# EAGLE schematic furby (EAGLE 6.3)
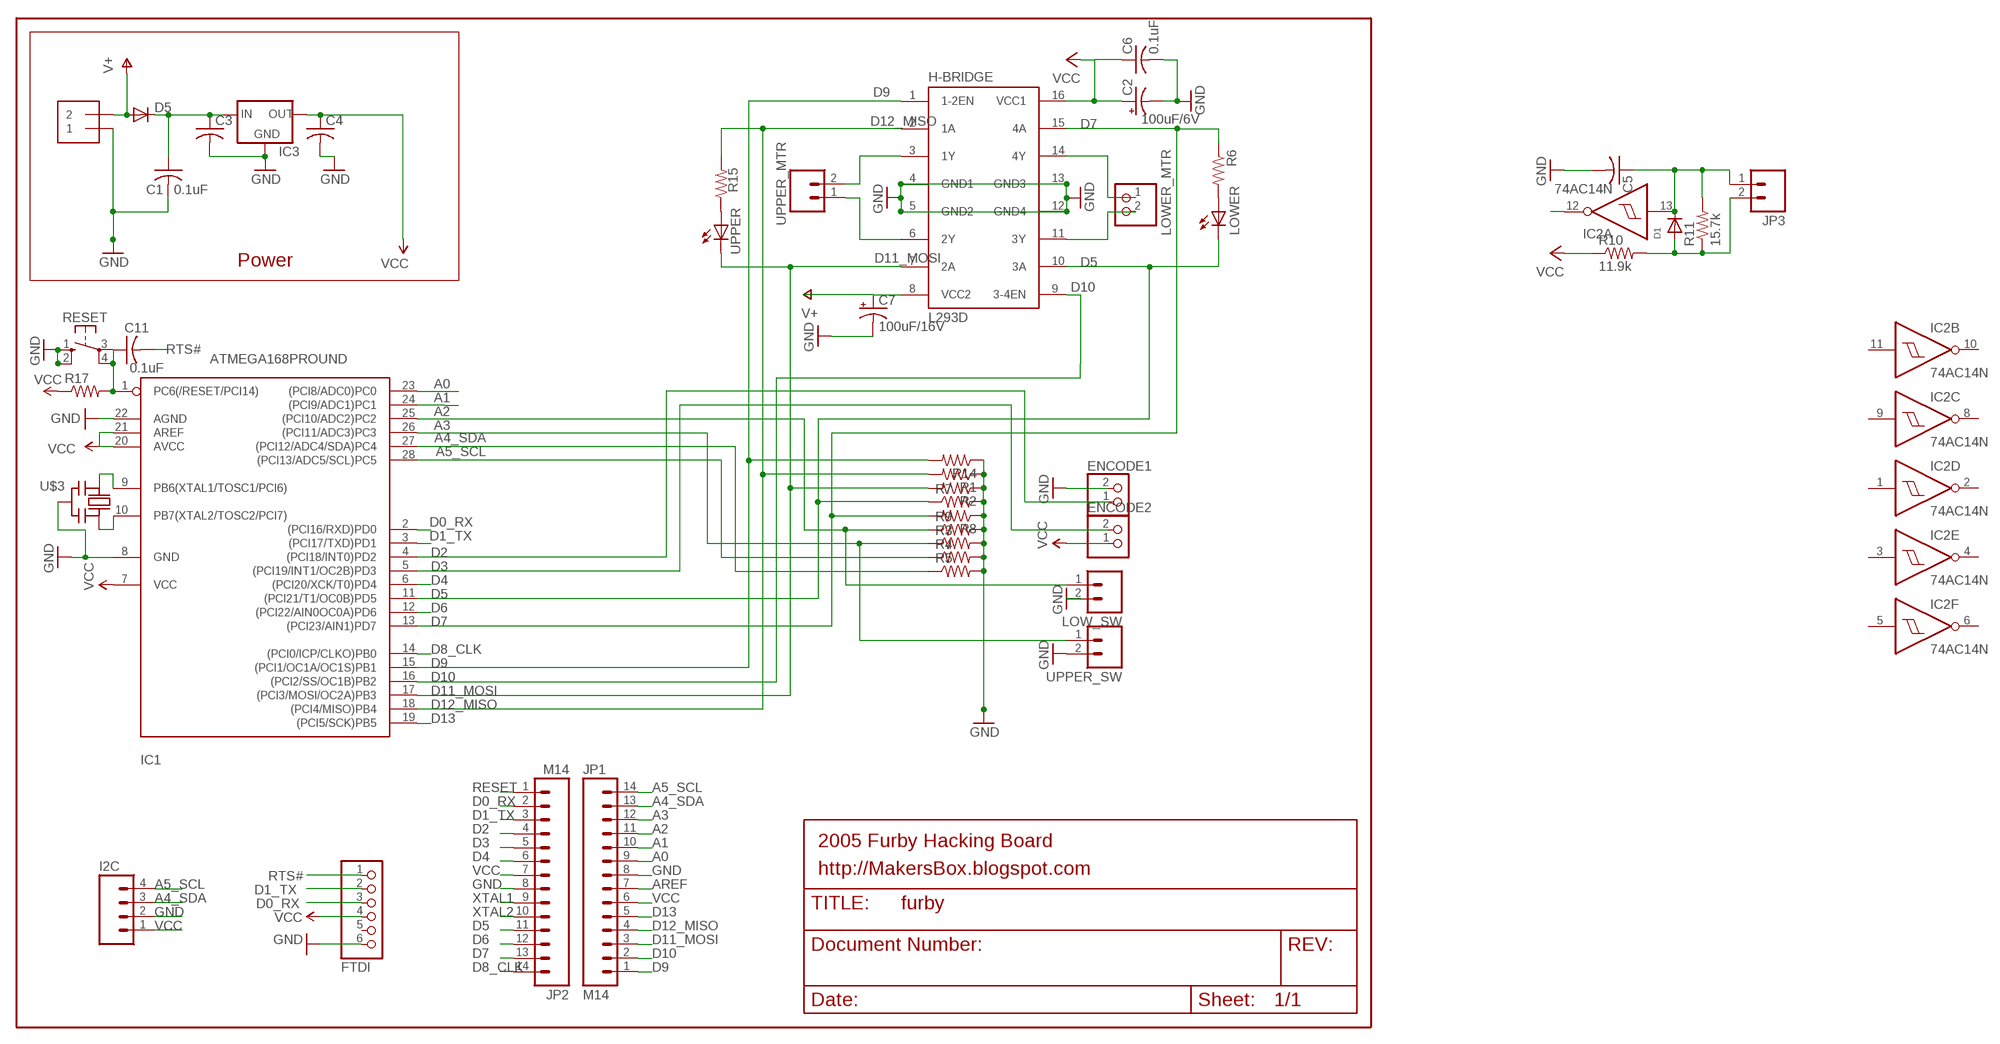
[diagram p0: schematic, sheet 1]

## Parts
C1  0.1uF  C-US025-025X050  [C025-025X050]
C2  100uF/6V  CPOL-USE2.5-5  [E2,5-5]
C3  C-US025-025X050  [C025-025X050]
C4  C-US025-025X050  [C025-025X050]
C5  C-US050-025X075  [C050-025X075]
C6  0.1uF  C-US025-025X050  [C025-025X050]
C7  100uF/16V  CPOL-USE2.5-6  [E2,5-6]
C11  0.1uF  C-US025-025X050  [C025-025X050]
D1  DIODEDO-1N4148  [DO-1N4148]
D5  DIODE-D-5  [D-5]
ENCODE1  JST_2PIN-THM  [JST-PH-2-THM]
ENCODE2  JST_2PIN-THM  [JST-PH-2-THM]
FTDI  FTDI  PINHD-1X6CB  [1X06-CLEANBIG]
H-BRIDGE  L293D  L293E  [DIL16]
I2C  M04PTH  [1X04]
IC1  ATMEGA168PROUND  [DIL28-3-ROUND]
IC2  74AC14N  [DIL14]
IC3  MCP1700INLINE  [TO92-INLINE]
J1  1X2-3.5MM  [1X2-3.5MM]
JP1  M14  [1X14]
JP2  M14  [1X14]
JP3  M02PTH  [1X02]
LOW_SW  M02PTH  [1X02]
LOWER  LED3MM  [LED3MM]
LOWER_MTR  JST_2PIN-THM  [JST-PH-2-THM]
R1  R-US_0207/2V  [0207/2V]
R2  R-US_0207/2V  [0207/2V]
R3  R-US_0207/2V  [0207/2V]
R4  RESISTORPTH-1/6W  [1/6W-RES]
R5  RESISTORPTH-1/6W  [1/6W-RES]
R6  R-US_0207/2V  [0207/2V]
R7  R-US_0207/2V  [0207/2V]
R8  R-US_0207/2V  [0207/2V]
R9  R-US_0207/2V  [0207/2V]
R10  11.9k  R-US_0204/7  [0204/7]
R11  15.7k  R-US_0204/7  [0204/7]
R14  R-US_0207/2V  [0207/2V]
R15  R-US_0207/2V  [0207/2V]
R17  R-US_0207/2V  [0207/2V]
RESET  10-XX  [B3F-10XX]
U$3  CERMOSCILL-THM  [CERM_OSC]
UPPER  LED3MM  [LED3MM]
UPPER_MTR  M02POLAR  [MOLEX-1X2]
UPPER_SW  M02PTH  [1X02]

## Nets
A0: IC1.23((PCI8/ADC0)PC0) JP1.9
A1: IC1.24((PCI9/ADC1)PC1) JP1.10
A2: IC1.25((PCI10/ADC2)PC2) JP1.11 LOW_SW.1 R9.1
A3: IC1.26((PCI11/ADC3)PC3) JP1.12 R3.1 UPPER_SW.1
A4_SDA: I2C.3 IC1.27((PCI12/ADC4/SDA)PC4) JP1.13 R5.1
A5_SCL: I2C.4 IC1.28((PCI13/ADC5/SCL)PC5) JP1.14 R4.1
AREF: JP1.7
D0_RX: FTDI.3 IC1.2((PCI16/RXD)PD0) JP2.2
D1_TX: FTDI.2 IC1.3((PCI17/TXD)PD1) JP2.3
D2: ENCODE1.1 IC1.4((PCI18/INT0)PD2) JP2.4
D3: ENCODE2.2 IC1.5((PCI19/INT1/OC2B)PD3) JP2.5
D4: IC1.6((PCI20/XCK/T0)PD4) JP2.6
D5: H-BRIDGE.10(3A) IC1.11((PCI21/T1/OC0B)PD5) JP2.11 LOWER.K(C) R7.1
D6: IC1.12((PCI22/AIN0OC0A)PD6) JP2.12
D7: H-BRIDGE.15(4A) IC1.13((PCI23/AIN1)PD7) JP2.13 R6.1 R8.2
D8_CLK: IC1.14((PCI0/ICP/CLKO)PB0) JP2.14
D9: H-BRIDGE.1(1-2EN) IC1.15((PCI1/OC1A/OC1S)PB1) JP1.1 R14.2
D10: H-BRIDGE.9(3-4EN) IC1.16((PCI2/SS/OC1B)PB2) JP1.2
D11_MOSI: H-BRIDGE.7(2A) IC1.17((PCI3/MOSI/OC2A)PB3) JP1.3 R2.2 UPPER.K(C)
D12_MISO: H-BRIDGE.2(1A) IC1.18((PCI4/MISO)PB4) JP1.4 R1.2 R15.2
D13: IC1.19((PCI5/SCK)PB5) JP1.5
GND [power]: C1.2 C2.- C3.2 C4.2 C5.2 C6.2 C7.- ENCODE1.2 FTDI.6 H-BRIDGE.4(GND1) H-BRIDGE.5(GND2) H-BRIDGE.12(GND4) H-BRIDGE.13(GND3) I2C.2 IC1.8(GND) IC1.22(AGND) IC3.1(GND) J1.1 JP1.8 JP2.8 LOW_SW.2 R1.1 R2.1 R3.2 R4.2 R5.2 R7.2 R8.1 R9.2 R14.1 RESET.1(S) RESET.2(S1) U$3.P$2(GND) UPPER_SW.2
N$1: H-BRIDGE.11(3Y) LOWER_MTR.2
N$2: LOWER.A R6.2
N$3: D1.A JP3.2 R10.2 R11.1
N$4: C5.1 D1.C IC2.13(A:I) JP3.1 R11.2
N$8: IC2.12(A:O)
N$9: R15.1 UPPER.A
N$22: H-BRIDGE.14(4Y) LOWER_MTR.1
N$24: C1.1 C3.1 D5.C IC3.2(IN)
N$25: H-BRIDGE.3(1Y) UPPER_MTR.2
N$28: H-BRIDGE.6(2Y) UPPER_MTR.1
RESET: C11.1 IC1.1(PC6(/RESET/PCI14)) JP2.1 R17.2 RESET.3(P) RESET.4(P1)
RTS#: C11.2 FTDI.1
V+: C7.+ D5.A H-BRIDGE.8(VCC2) J1.2
VCC: C2.+ C4.1 C6.1 ENCODE2.1 FTDI.4 H-BRIDGE.16(VCC1) I2C.1 IC1.7(VCC) IC1.20(AVCC) IC1.21(AREF) IC3.3(OUT) JP1.6 JP2.7 R10.1 R17.1
XTAL1: IC1.9(PB6(XTAL1/TOSC1/PCI6)) JP2.9 U$3.P$1(IN)
XTAL2: IC1.10(PB7(XTAL2/TOSC2/PCI7)) JP2.10 U$3.P$3(OUT)
Unconnected: FTDI.5 IC2.1(D:I) IC2.2(D:O) IC2.3(E:I) IC2.4(E:O) IC2.5(F:I) IC2.6(F:O) IC2.8(C:O) IC2.9(C:I) IC2.10(B:O) IC2.11(B:I)

## Notes on the sheet
- Power
- 2005 Furby Hacking Board
- http://MakersBox.blogspot.com

## Power pins joined to a net without a drawn wire
GND: IC2.7(P:GND)
VCC: IC2.14(P:VCC)

## Library data of the parts
C1 C11 = minimidi:C-US: CAPACITOR, American symbol
C2 C7 = rcl-ez:CPOL-US: POLARIZED CAPACITOR, American symbol
C3-C5 = adafruit:C-US: CAPACITOR, American symbol
C6 = rcl-ez:C-US: CAPACITOR, American symbol
D1 = adafruit:DIODE: Diode SMADIODE - SMA Surface Mount Package 20V 1A Schottky Diode Digikey: 641-1014-6-ND DO-1N4148 - Through Hole Small Current Diode SOD-123 20V 1 A (.5mV Vf) Schottky Diode - Digikey: MBRX120TPMSCT-ND SOD-323 10V 570mA (.38mV Vf, 3ns) Schottky Diode - Digikey: ZLLS410CT-ND SOD-523 30V 30mA Schottky Diode (RB751S-40TE61) - Digikey: RB751S-40TE61CT-ND SOT23-R/W - SOT23 Package (R = Solder Paste/Reflow Ovens, W = Hand-Soldering) BAT54Film 40V 300mA - Digikey: 497-7162-1-ND
D5 = diode:DIODE-: DIODE
ENCODE1 ENCODE2 LOWER_MTR = adafruit_mod:JST_2PIN: JST 2-Pin Connectors of various flavors SMT-RA (S2B-PH-SM4) 4UConnector #17311 SMT (B2B-PH-SM4) THM-RA (S2B-PH) THM (B2B-PH)
FTDI = carduino:PINHD-1X6: PIN HEADER
H-BRIDGE = texas:L293E: TI DEVICE
I2C = SparkFun:M04: Header 4 Standard 4-pin 0.1" header. Use with straight break away headers (SKU : PRT-00116), right angle break away headers (PRT-00553), swiss pins (PRT-00743), machine pins (PRT-00117), and female headers (PRT-00115). Molex polarized connector foot print use with SKU : PRT-08231 with associated crimp pins and housings. 1MM SMD Version SKU: PRT-10208
IC1 = adafruit:ATMEGA168*P: MICROCONTROLLER 16 kBytes FLASH 1 kBytes SRAM 512 Bytes EEPROM USART 8-channel 10 bit ADC
IC2 = 74xx-eu:74*14: Hex schmitt trigger INVERTER
IC3 = adafruit:MCP1700: VOLTAGE REGULATOR
J1 = adafruit:1X2: 3.5mm Terminal block http://www.ladyada.net/library/pcb/eaglelibrary.html
JP1 JP2 = SparkFun_mod:M14: Header 14 Standard 14-pin 0.1" header. Use with straight break away headers (SKU : PRT-00116), right angle break away headers (PRT-00553), swiss pins (PRT-00743), machine pins (PRT-00117), and female headers (PRT-00115).
JP3 LOW_SW UPPER_MTR UPPER_SW = SparkFun:M02: Header 2 Standard 2-pin 0.1" header. Use with straight break away headers (SKU : PRT-00116), right angle break away headers (PRT-00553), swiss pins (PRT-00743), machine pins (PRT-00117), and female headers (PRT-00115). Molex polarized connector foot print use with SKU : PRT-08233 with associated crimp pins and housings.
LOWER UPPER = minimidi:LED: LED OSRAM: - CHIPLED LG R971, LG N971, LY N971, LG Q971, LY Q971, LO R971, LY R971 LH N974, LH R974 LS Q976, LO Q976, LY Q976 LO Q996 - Hyper CHIPLED LW Q18S LB Q993, LB Q99A, LB R99A - SideLED LS A670, LO A670, LY A670, LG A670, LP A670 LB A673, LV A673, LT A673, LW A673 LH A674 LY A675 LS A676, LA A676, LO A676, LY A676, LW A676 LS A679, LY A679, LG A679 - Hyper Micro SIDELED® LS Y876, LA Y876, LO Y876, LY Y876 LT Y87S - SmartLED LW L88C, LW L88S LB L89C, LB L89S, LG L890 LS L89K, LO L89K, LY L89K LS L896, LA L896, LO L896, LY L896 - TOPLED LS T670, LO T670, LY T670, LG T670, LP T670 LSG T670, LSP T670, LSY T670, LOP T670, LYG T670 LG T671, LOG T671, LSG T671 LB T673, LV T673, LT T673, LW T673 LH T674 LS T676, LA T676, LO T676, LY T676, LB T676, LH T676, LSB T676, LW T676 LB T67C, LV T67C, LT T67C, LS T67K, LO T67K, LY T67K, LW E67C LS E67B, LA E67B, LO E67B, LY E67B, LB E67C, LV E67C, LT E67C LW T67C LS T679, LY T679, LG T679 LS T770, LO T770, LY T770, LG T770, LP T770 LB T773, LV T773, LT T773, LW T773 LH T774 LS E675, LA E675, LY E675, LS T675 LS T776, LA T776, LO T776, LY T776, LB T776 LHGB T686 LT T68C, LB T68C - Hyper Mini TOPLED® LB M676 - Mini TOPLED Santana® LG M470 LS M47K, LO M47K, LY M47K Source: http://www.osram.convergy.de/
R1-R3 R6-R11 R14 R15 R17 = adafruit:R-US_: RESISTOR, American symbol
R4 R5 = SparkFun:RESISTOR: Resistor Basic schematic elements and footprints for 0603, 1206, and PTH resistors.
RESET = switch-omron:10-XX: OMRON SWITCH
U$3 = adafruit:CERMOSCILL: Ceramic oscillator with built in capacitors such as ZTT-12MHz http://www.ladyada.net/library/eagle

## Net classes
1 power: width 0.61 mm